# Altium schematic sheet interface-board.SchDoc
size A; SheetNumber: 1; SheetTotal: 1
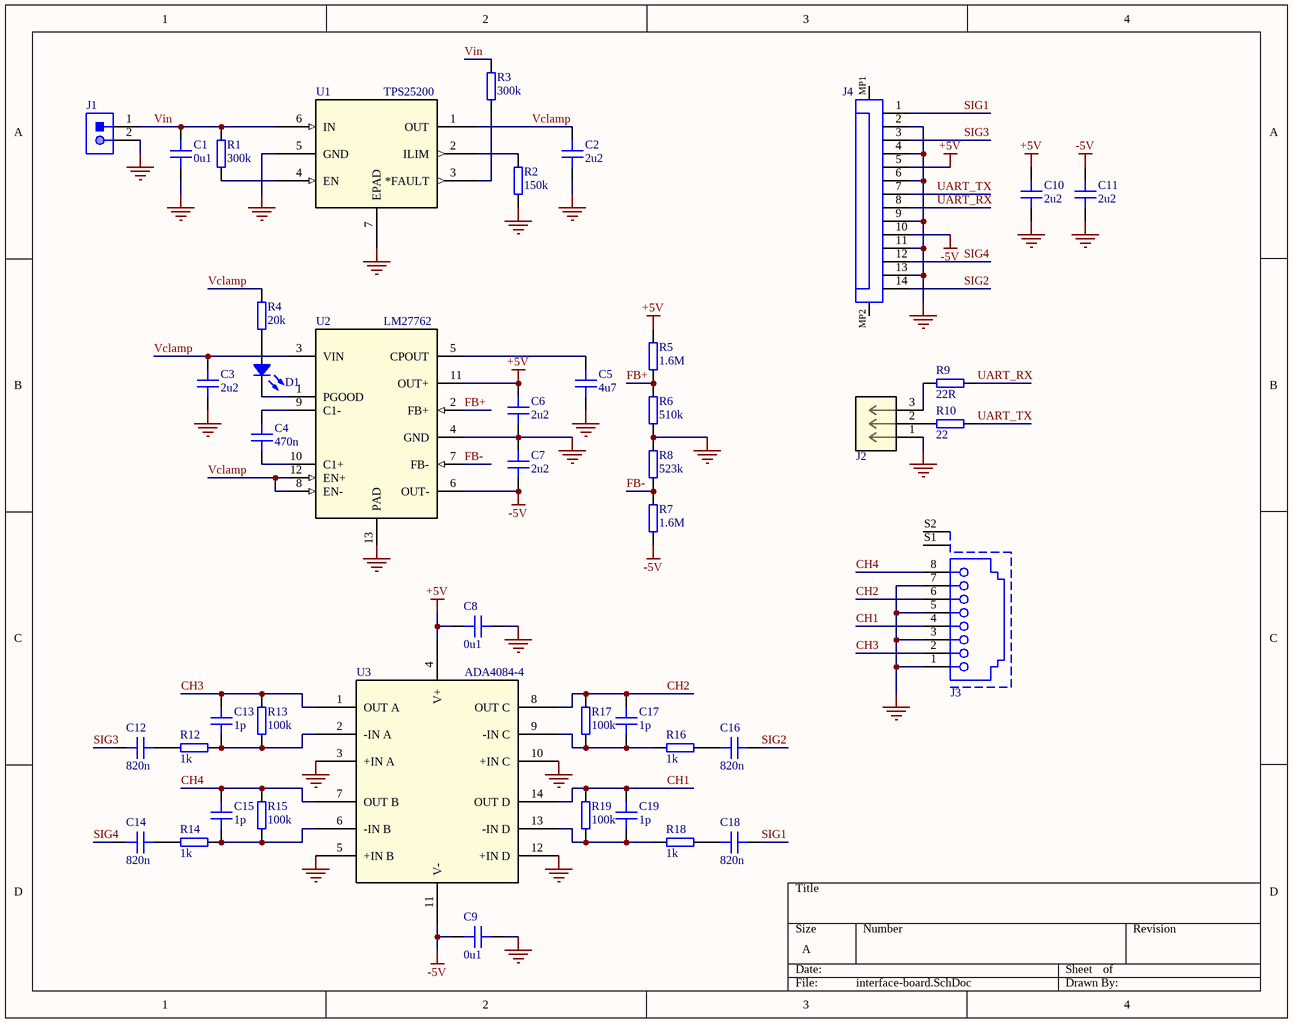
[diagram p0: interface-board.SchDoc]

## Parts
C1  0u1  [CAP_0402]
C2  2u2  [CAP_0402]
C3  2u2  [CAP_0402]
C4  470n  [CAP_0402]
C5  4u7  [CAP_0402]
C6  2u2  [CAP_0402]
C7  2u2  [CAP_0402]
C8  0u1  [CAP_0402]
C9  0u1  [CAP_0402]
C10  2u2  [CAP_0402]
C11  2u2  [CAP_0402]
C12  820n  [CAP_0402]
C13  1p  [CAP_0402]
C14  820n  [CAP_0402]
C15  1p  [CAP_0402]
C16  820n  [CAP_0402]
C17  1p  [CAP_0402]
C18  820n  [CAP_0402]
C19  1p  [CAP_0402]
D1  LED_0402  [LED_0402]  (value not drawn)
J1  XH_2.54_2P  [XH_2.54_2P]  (value not drawn)
J2  PH_2.0_3P  [PH_2.0_3P]  (value not drawn)
J3  RJ45  [RJ45]  (value not drawn)
J4  FPC_0.5_14P  [FPC_0.5_14P]  (value not drawn)
R1  300k  [RES_0402]
R2  150k  [RES_0402]
R3  300k  [RES_0402]
R4  20k  [RES_0402]
R5  1.6M  [RES_0402]
R6  510k  [RES_0402]
R7  1.6M  [RES_0402]
R8  523k  [RES_0402]
R9  22R  [RES_0402]
R10  22  [RES_0402]
R12  1k  [RES_0402]
R13  100k  [RES_0402]
R14  1k  [RES_0402]
R15  100k  [RES_0402]
R16  1k  [RES_0402]
R17  100k  [RES_0402]
R18  1k  [RES_0402]
R19  100k  [RES_0402]
U1  TPS25200  [TPS25200]
U2  LM27762  [LM27762]
U3  ADA4084-4  [ADA4084-4]

## Nets
+5V: C6.2 C8.2 C10.1 J4.5 R5.2 U2.11(OUT+) U3.4(V+)
-5V: C7.1 C9.2 C11.1 J4.10 R7.1 U2.6(OUT-) U3.11(V-)
GND: C1.1 C2.1 C3.1 C5.1 C6.1 C7.2 C8.1 C9.1 C10.2 C11.2 J1.2 J2.1 J3.1 J3.3 J3.5 J3.7 J4.2 J4.4 J4.6 J4.9 J4.11 J4.13 R2.1 R6.1 R8.2 U1.5(GND) U1.7(EPAD) U2.4(GND) U2.13(PAD) U3.3(+IN_A) U3.5(+IN_B) U3.10(+IN_C) U3.12(+IN_D)
CH1: C19.1 J3.4 R19.1 U3.14(OUT_D)
CH2: C17.1 J3.6 R17.1 U3.8(OUT_C)
CH3: C13.1 J3.2 R13.1 U3.1(OUT_A)
CH4: C15.1 J3.8 R15.1 U3.7(OUT_B)
FB+: R5.1 R6.2 U2.2(FB+)
FB-: R7.2 R8.1 U2.7(FB-)
SIG1: C18.1 J4.1
SIG2: C16.1 J4.14
SIG3: C12.1 J4.3
SIG4: C14.1 J4.12
UART_RX: J4.8 R9.1
UART_TX: J4.7 R10.1
Vclamp: C2.2 C3.2 R4.2 U1.1(OUT) U2.3(VIN) U2.8(EN-) U2.12(EN+)
Vin: C1.2 J1.1 R1.2 R3.2 U1.6(IN)
NetC4_1: C4.1 U2.10(C1+)
NetC4_2: C4.2 U2.9(C1-)
NetC5_2: C5.2 U2.5(CPOUT)
NetC12_2: C12.2 R12.2
NetC13_2: C13.2 R12.1 R13.2 U3.2(-IN_A)
NetC14_2: C14.2 R14.2
NetC15_2: C15.2 R14.1 R15.2 U3.6(-IN_B)
NetC16_2: C16.2 R16.2
NetC17_2: C17.2 R16.1 R17.2 U3.9(-IN_C)
NetC18_2: C18.2 R18.2
NetC19_2: C19.2 R18.1 R19.2 U3.13(-IN_D)
NetD1_A: D1.A R4.1
NetD1_K: D1.K U2.1(PGOOD)
NetJ2_2: J2.2 R10.2
NetJ2_3: J2.3 R9.2
NetR1_1: R1.1 U1.4(EN)
NetR2_2: R2.2 U1.2(ILIM)
NetR3_1: R3.1 U1.3(*FAULT)

Not connected (* = marked no-connect by the designer): J3 S1 S2; J4 MP1 MP2

## Library data of the parts
C1-C19 = CAP_0402: Capacitor SMD 0402; Voltage: 50V
  C1 C8 C9: Capacitance: 0u1
  C2 C3 C6 C7 C10 C11: Capacitance: 2u2
  C4: Capacitance: 470n
  C5: Capacitance: 4u7
  C12 C14 C16 C18: Capacitance: 820n
  C13 C15 C17 C19: Capacitance: 1p
D1 = LED_0402: LED SMD 0402
J1 = XH_2.54_2P: XH, pitch 2.54 mm, 2 pisition
J2 = PH_2.0_3P: PH, pitch 2.0 mm, 3 pisition
J4 = FPC_0.5_14P: FPC, Horizontal, pitch 0.5 mm, 14 pins
R1-R10 R12-R19 = RES_0402: Resistor SMD 0402
  R1 R3: Resistance: 300k
  R2: Resistance: 150k
  R4: Resistance: 20k
  R5 R7: Resistance: 1.6M
  R6: Resistance: 510k
  R8: Resistance: 523k
  R9: Resistance: 22R
  R10: Resistance: 22
  R12 R14 R16 R18: Resistance: 1k
  R13 R15 R17 R19: Resistance: 100k
U1 = TPS25200: 5-V eFuse With Precision Adjustable Current Limit and Overvoltage Clamp; Mfr_Name: Texas Instruments; Manufacturer_Part_Number: TPS25200DRVR; Copyright: Copyright (C) 2023 Ultra Librarian. All rights reserved.; RefDes: RefDes; Type: DEV
U2 = LM27762: Low-Noise Positive and Negative Output Integrated Charge Pump Plus LDO; Mfr_Name: Texas Instruments; Manufacturer_Part_Number: LM27762DSSR; Type: DEV; RefDes: RefDes; Copyright: Copyright (C) 2023 Ultra Librarian. All rights reserved.; Digi-Key_Part_Number_1: 296-47331-1-ND; Digi-Key_Part_Number_2: 296-47331-2-ND; Digi-Key_Part_Number_3: 296-47331-6-ND; Digi-Key_Part_Number_4: 2156-LM27762DSSR-ND
U3 = ADA4084-4: 30 V, Low Noise, Rail-to-Rail Input/Output, / Low Power Operational Amplifiers